# EasyEDA schematic espwithDRV2880.json
TITLE: Sheet_1; REV: 1.0; Date: 2025-06-25; Sheet: 1/1; Drawn By: iishii; Company: Your Company
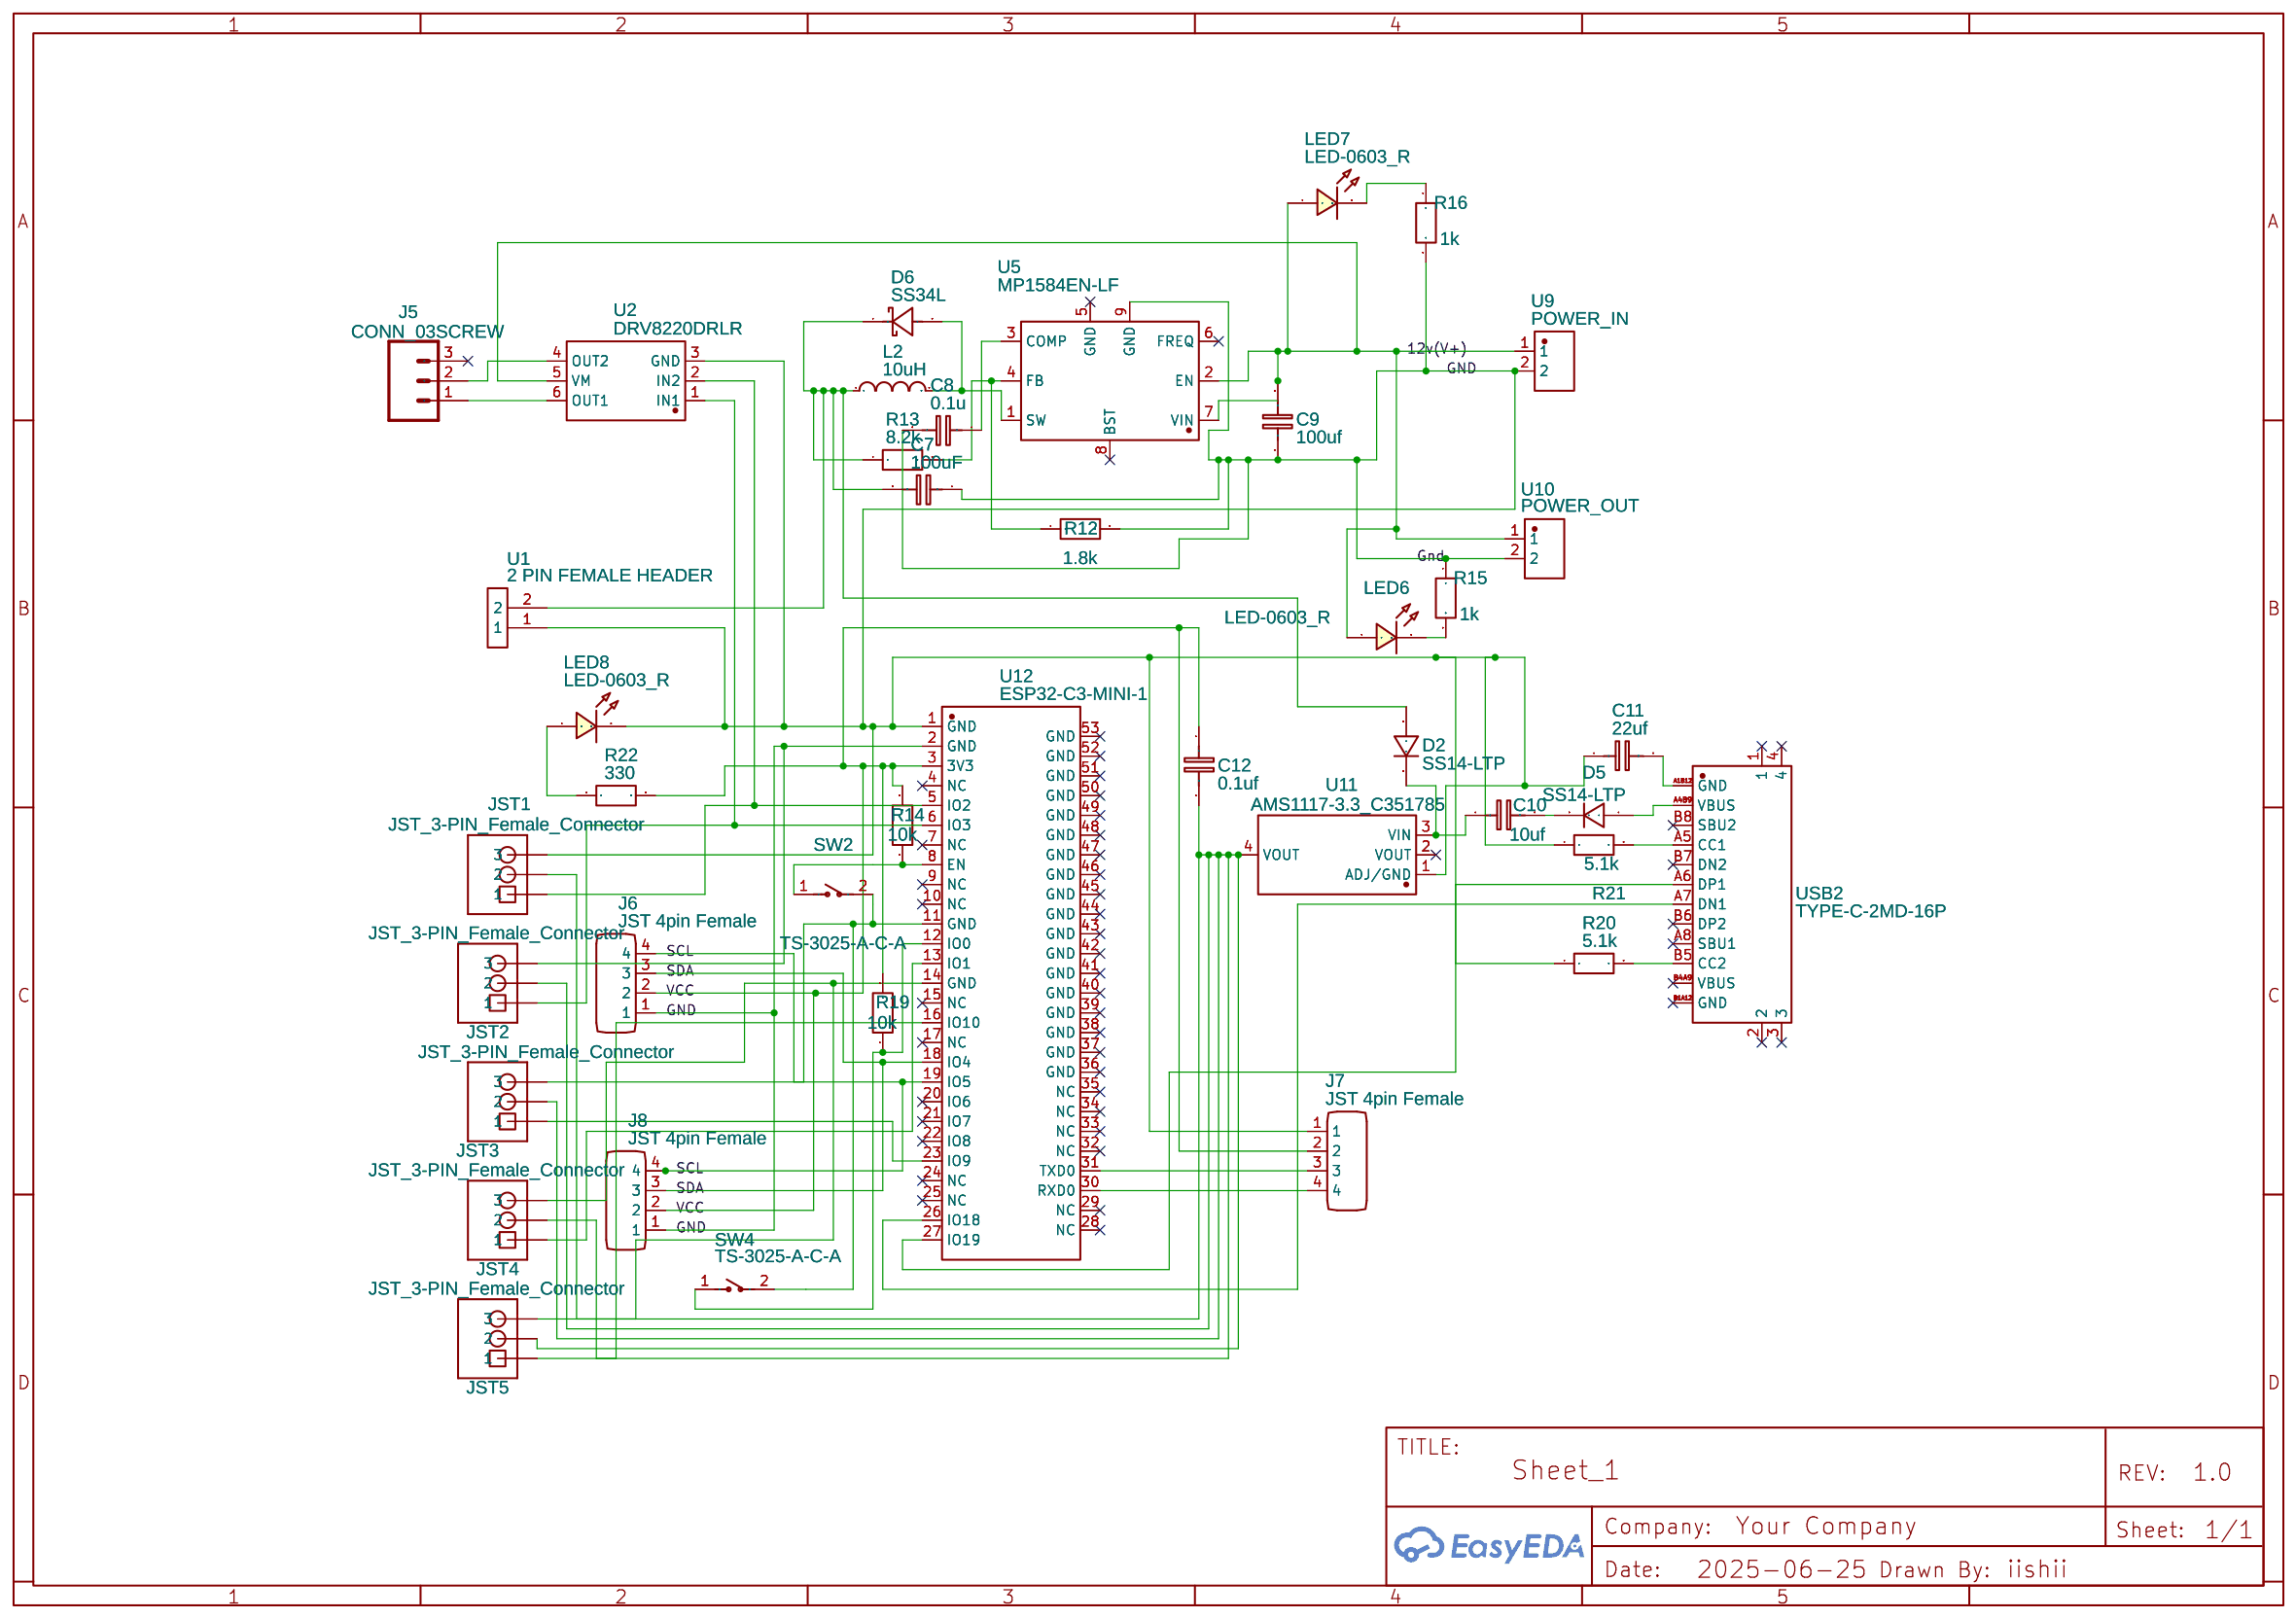
[diagram p0: schematic sheet]

## Parts
C7  100uF  [C0603]
C8  0.1u  [C0603]
C9  100uf  [C0603]
C10  10uf  [C0603]
C11  22uf  [C0603]
C12  0.1uf  [C0603]
D2  SS14-LTP  [SMA_L4.4-W2.8-LS5.4-R-RD]
D5  SS14-LTP  [SMA_L4.4-W2.8-LS5.4-R-RD]
D6  SS34L  [SMF_L2.8-W1.8-LS3.7-RD]
J5  CONN_03SCREW  [SCREWTERMINAL-3.5MM-3]
J6  JST 4pin Female  [JST 4 PIN FEMALE]
J7  JST 4pin Female  [JST 4 PIN FEMALE]
J8  JST 4pin Female  [JST 4 PIN FEMALE]
JST1  JST_3-PIN_Female_Connector  [JST_XH_3_PIN_TOP_ENTRY]
JST2  JST_3-PIN_Female_Connector  [JST_XH_3_PIN_TOP_ENTRY]
JST3  JST_3-PIN_Female_Connector  [JST_XH_3_PIN_TOP_ENTRY]
JST4  JST_3-PIN_Female_Connector  [JST_XH_3_PIN_TOP_ENTRY]
JST5  JST_3-PIN_Female_Connector  [JST_XH_3_PIN_TOP_ENTRY]
L2  10uH  [L0603]
LED6  LED-0603_R  [LED0603_RED]
LED7  LED-0603_R  [LED0603_RED]
LED8  LED-0603_R  [LED0603_RED]
R12  1.8k  [R0603]
R13  8.2k  [R0603]
R14  10k  [R0603]
R15  1k  [R0603]
R16  1k  [R0603]
R19  10k  [R0603]
R20  5.1k  [R0603]
R21  5.1k  [R0603]
R22  330  [R0603]
SW2  TS-3025-A-C-A  [SW-SMD_L3.0-W2.5-P3.40-LS4.0-EH]
SW4  TS-3025-A-C-A  [SW-SMD_L3.0-W2.5-P3.40-LS4.0-EH]
U1  2 PIN FEMALE HEADER  [2PIN FEMALE HEADER]
U2  DRV8220DRLR  [SOT-563_L1.6-W1.2-P0.50-LS1.6-BL]
U5  MP1584EN-LF  [SOIC-8_L4.9-W3.9-P1.27-LS6.0-BL-EP3.3-1]
U9  POWER_IN  [CONN-TH_B2PS-VH-LF-SN]
U10  POWER_OUT  [CONN-TH_B2PS-VH-LF-SN]
U11  AMS1117-3.3_C351785  [SOT-223_L6.5-W3.5-P2.30-LS7.0-BR]
U12  ESP32-C3-MINI-1  [WIFIM-SMD_ESP32-C3-MINI-1]
USB2  TYPE-C-2MD-16P  [USB-C-SMD_TYPE-C-2MD-16P]

## Library data of the parts
C7-C12 = C_0603_EU: Contributor: LCEDA_Lib
D2 D5 = SS14-LTP: Contributor: LCSC; Supplier: LCSC; Supplier Part: C78574; Manufacturer: MCC(美微科); JLCPCB Part Class: Extended Part
D6 = SS34L: Supplier: LCSC; Supplier Part: C3003093; Manufacturer: Hottech(合科泰); JLCPCB Part Class: Extended Part; Contributor: lcsc
J5 = CONN_03SCREW: Contributor: fparodo
J6-J8 = JST 4pin Female: Contributor: matthijssmit
JST1-JST5 = JST_3-PIN_Female_Connector: Contributor: fabiano.riccardi
L2 = L0603_US: Contributor: LCEDA_Lib
LED6-LED8 = LED-0603_R: Manufacturer: EVERLIGHT(台湾亿光); Manufacturer Part: 19-217/R6C-AL1M2VY/3T; Supplier Part: C72044; Supplier: LCSC; Contributor: LCEDA_01
R12-R16 R19-R22 = R_0603_EU: Contributor: LCEDA_Lib
SW2 SW4 = TS-3025-A-C-A: Supplier: LCSC; Supplier Part: C21262543; Manufacturer: XKB Connection(中国星坤); Contributor: lcsc; JLCPCB Part Class: Extended Part
U1 = 2 PIN FEMALE HEADER: Manufacturer Part: 4 Pin Female Header; link: https://a.pololu-files.com/picture/0J880.1200.jpg?97bf8a1d9d7fd4e66a3c71ca1c7a873e; Contributor: Austin Livengood
U2 = DRV8220DRLR: Contributor: lcsc; Supplier: LCSC; Supplier Part: C3681351; Manufacturer: TI(德州仪器); JLCPCB Part Class: Extended Part
U5 = MP1584EN-LF: Supplier: LCSC; Supplier Part: C21999497; Manufacturer: MPS(芯源); Contributor: lcsc
U9 U10 = JST-B2PS-VH(LF)(SN)黑色: Contributor: LCSC; Supplier: LCSC; Supplier Part: C9900004853; Manufacturer: null; JLCPCB Part Class: Extended Part
U11 = AMS1117-3.3_C351785: Contributor: LCSC; Supplier: LCSC; Supplier Part: C351785; Manufacturer: PUOLOP(迪浦); Manufacturer Part: AMS1117-3.3; JLCPCB Part Class: Extended Part
U12 = ESP32-C3-MINI-1: Contributor: lcsc; Supplier: LCSC; Supplier Part: C5290152; Manufacturer: RF Crazy(智汉); JLCPCB Part Class: Extended Part
USB2 = TYPE-C-2MD-16P: Supplier: LCSC; Supplier Part: C42418793; Manufacturer: JXTCONN(聚兴泰); Contributor: lcsc

## Nets
12v(V+): C9.2 LED6.1 LED7.1 U2.5(VM) U5.2(EN) U5.7(VIN) U9.1 U10.1
GND: C7.1 C8.2 C9.1 C11.1 J6.1 J7.1 J8.1 JST1.3 JST2.3 LED8.2 R12.2 R15.1 R16.2 R20.1 R21.1 U1.1 U2.3(GND) U5.9(GND) U9.2 U10.2 U11.1(ADJ/GND) U12.1(GND) U12.2(GND)
VCC: C12.1 J6.2 J7.2 J8.2 R14.2 R19.2 R22.2 U12.3(3V3)
SCL: J6.4 J8.4 U12.19(IO5)
SDA: J6.3 J8.3 U12.18(IO4)
Net-(C7-2): C7.2 D2.1(A) D6.1(C) L2.1 R13.1 U1.2
Net-(C8-1): C8.1 U5.3(COMP)
Net-(C10-1): C10.1 D2.2(K) U11.3(VIN)
Net-(C10-2): C10.2 D5.2(K)
Net-(C11-2): C11.2 USB2.A1B12(GND)
Net-(C12-2): C12.2 JST1.2 JST2.2 JST3.2 JST4.2 JST5.2 U11.4(VOUT)
Net-(D5-1): D5.1(A) USB2.A4B9(VBUS)
Net-(D6-2): D6.2(A) L2.2 U5.1(SW)
Net-(J5-1): J5.1 U2.6(OUT1)
Net-(J5-2): J5.2 U2.4(OUT2)
Net-(J7-3): J7.3 U12.31(TXD0)
Net-(J7-4): J7.4 U12.30(RXD0)
Net-(JST1-1): JST1.1 U2.2(IN2) U12.5(IO2)
Net-(JST2-1): JST2.1 U2.1(IN1) U12.6(IO3)
Net-(JST3-1): JST3.1 U12.23(IO9)
Net-(JST3-3): JST3.3 SW2.2 SW4.2 U12.11(GND)
Net-(JST4-1): JST4.1 U12.13(IO1)
Net-(JST4-3): JST4.3 JST5.3 U12.14(GND)
Net-(JST5-1): JST5.1 U12.16(IO10)
Net-(LED6-2): LED6.2 R15.2
Net-(LED7-2): LED7.2 R16.1
Net-(LED8-1): LED8.1 R22.1
Net-(R12-1): R12.1 R13.2 U5.4(FB)
Net-(R14-1): R14.1 SW2.1 U12.8(EN)
Net-(R19-1): R19.1 SW4.1 U12.12(IO0)
Net-(R20-2): R20.2 USB2.B5(CC2)
Net-(R21-2): R21.2 USB2.A5(CC1)
Net-(U12-26): U12.26(IO18) USB2.A7(DN1)
Net-(U12-27): U12.27(IO19) USB2.A6(DP1)

Not connected (* = marked no-connect by the designer): J5 3*; U5 5(GND)* 6(FREQ)* 8(BST)*; U11 2(VOUT)*; U12 4(NC)* 7(NC)* 9(NC)* 10(NC)* 15(NC)* 17(NC)* 20(IO6)* 21(IO7)* 22(IO8)* 24(NC)* 25(NC)* 28(NC)* 29(NC)* 32(NC)* 33(NC)* 34(NC)* 35(NC)* 36(GND)* 37(GND)* 38(GND)* 39(GND)* 40(GND)* 41(GND)* 42(GND)* 43(GND)* 44(GND)* 45(GND)* 46(GND)* 47(GND)* 48(GND)* 49(GND)* 50(GND)* 51(GND)* 52(GND)* 53(GND)*; USB2 1* 2* 3* 4* A8(SBU1)* B1A12(GND)* B4A9(VBUS)* B6(DP2)* B7(DN2)* B8(SBU2)*
